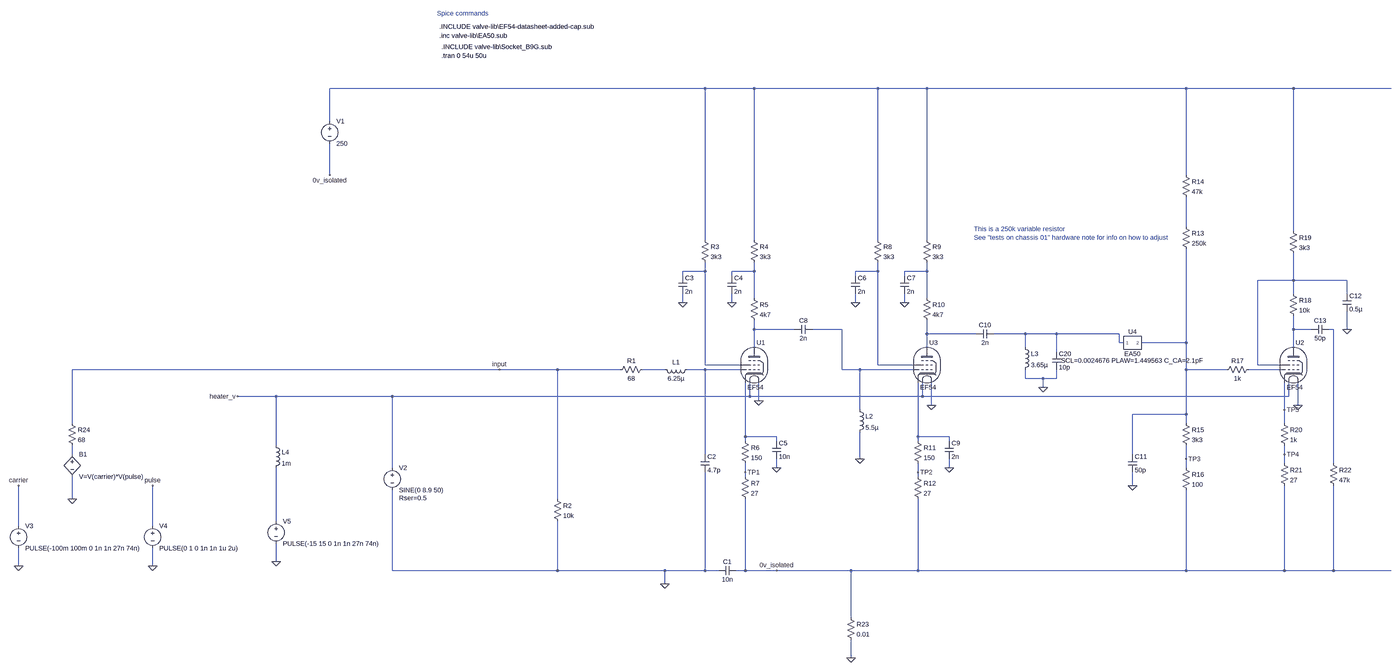
[diagram p0: schematic store_regen_input.asc, whole sheet]
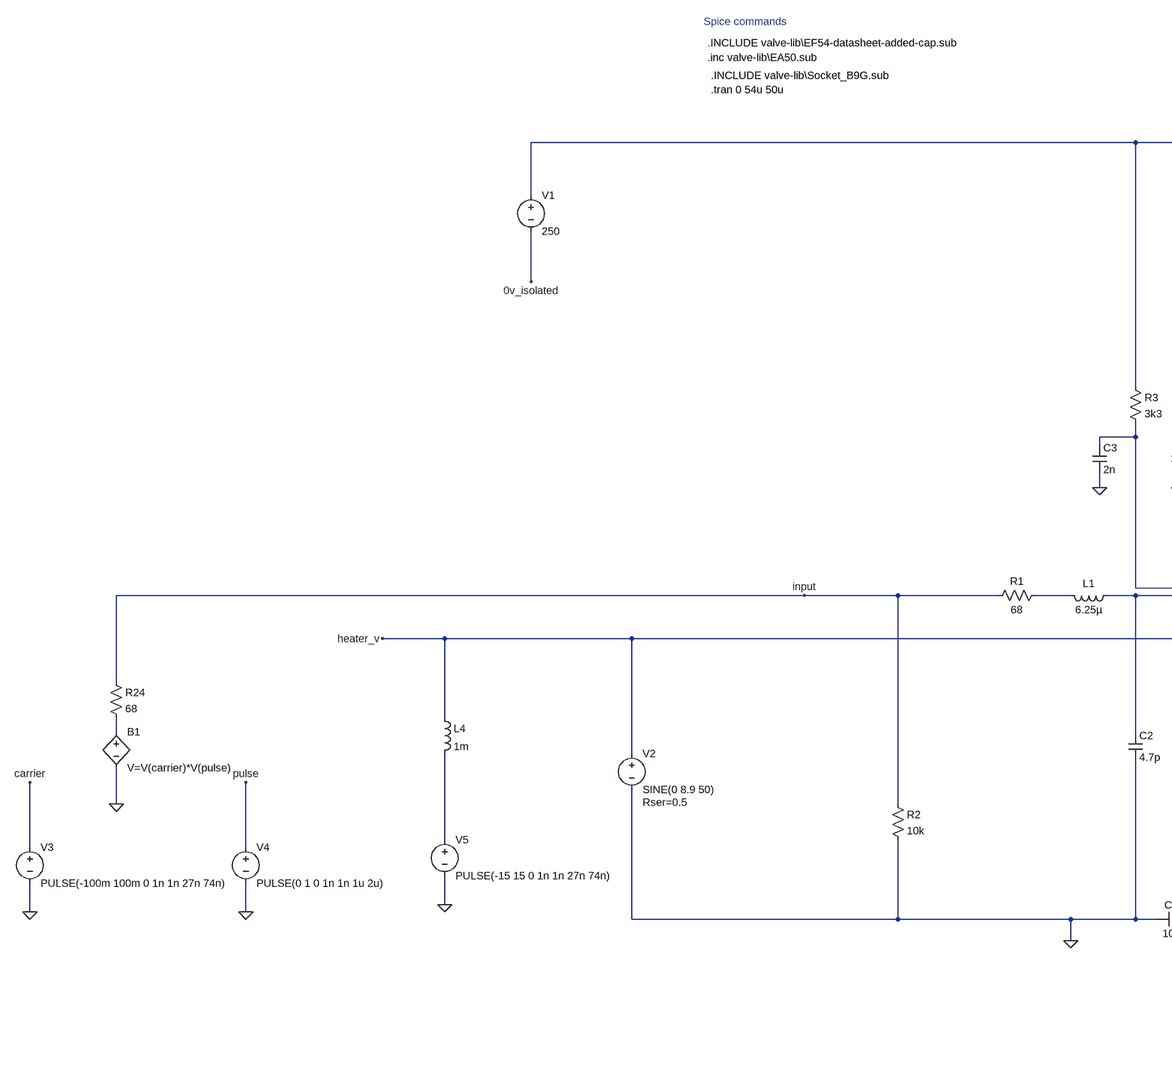
[diagram p1: schematic store_regen_input.asc, part, row 1 of 1, column 1 of 2]
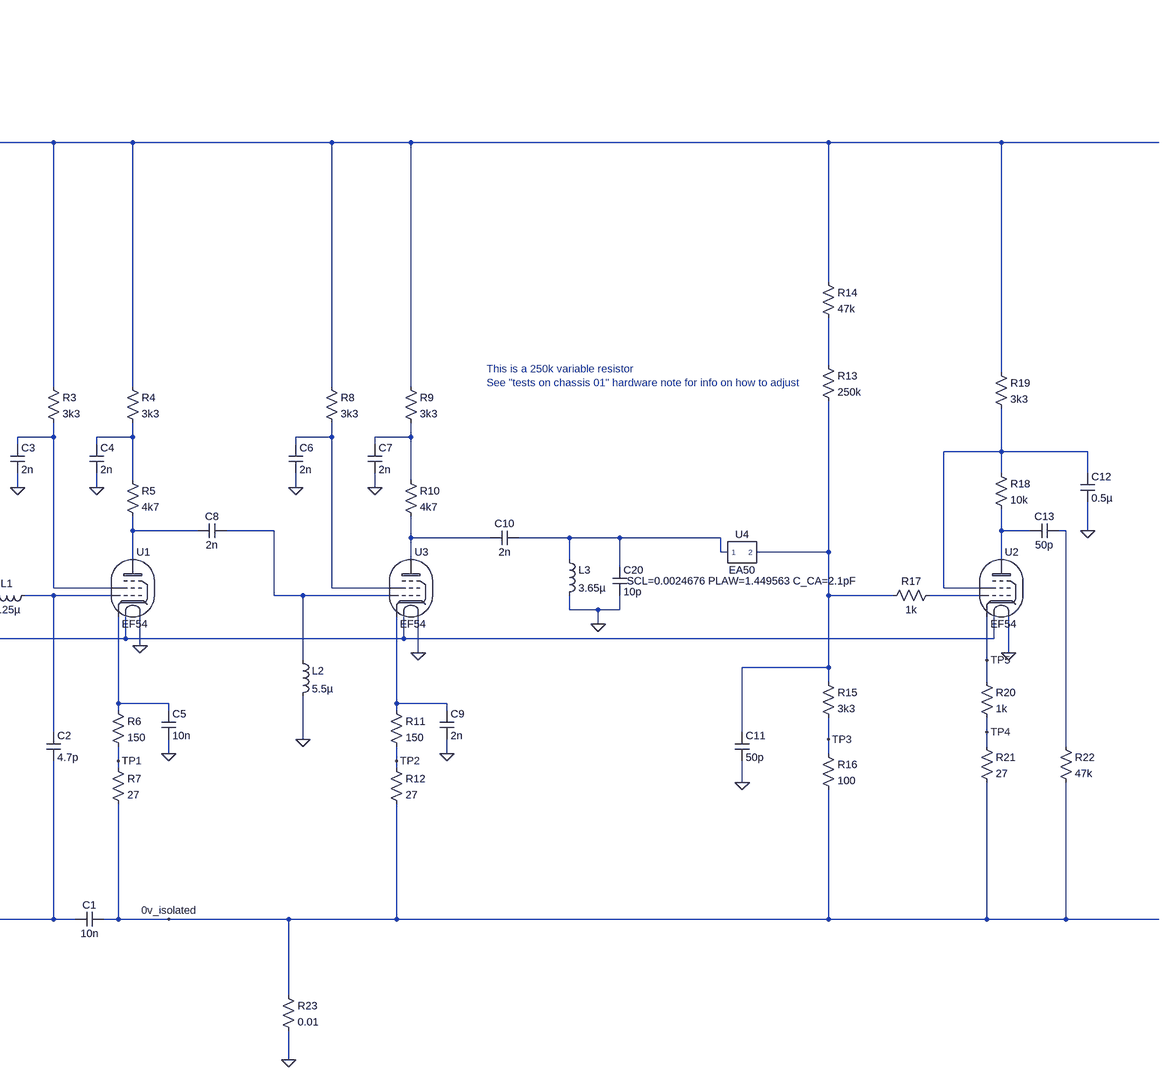
[diagram p2: schematic store_regen_input.asc, part, row 1 of 1, column 2 of 2]
store_regen_input.asc, the LTspice schematic file:
Version 4
SHEET 1 3124 1892
WIRE 240 -368 -1104 -368
WIRE 416 -368 240 -368
WIRE 880 -368 416 -368
WIRE 1056 -368 880 -368
WIRE 1984 -368 1056 -368
WIRE 2368 -368 1984 -368
WIRE 3120 -368 2368 -368
WIRE -1104 -80 -1104 -368
WIRE -1104 112 -1104 0
WIRE 1984 112 1984 -368
WIRE 1984 304 1984 192
WIRE 2368 320 2368 -368
WIRE 240 352 240 -368
WIRE 416 352 416 -368
WIRE 880 352 880 -368
WIRE 1056 352 1056 -368
WIRE 240 464 240 432
WIRE 240 464 160 464
WIRE 416 464 416 432
WIRE 416 464 336 464
WIRE 880 464 880 432
WIRE 880 464 800 464
WIRE 1056 464 1056 432
WIRE 1056 464 976 464
WIRE 160 480 160 464
WIRE 336 480 336 464
WIRE 800 480 800 464
WIRE 976 480 976 464
WIRE 2368 496 2368 400
WIRE 2368 496 2240 496
WIRE 2560 496 2368 496
WIRE 2368 544 2368 496
WIRE 2560 544 2560 496
WIRE 416 560 416 464
WIRE 1056 560 1056 464
WIRE 160 576 160 544
WIRE 336 576 336 544
WIRE 800 576 800 544
WIRE 976 576 976 544
WIRE 416 672 416 640
WIRE 560 672 416 672
WIRE 752 672 624 672
WIRE 2368 672 2368 624
WIRE 2432 672 2368 672
WIRE 2512 672 2496 672
WIRE 2560 672 2560 608
WIRE 1056 688 1056 640
WIRE 1232 688 1056 688
WIRE 1408 688 1296 688
WIRE 1520 688 1408 688
WIRE 1744 688 1520 688
WIRE 1744 720 1744 688
WIRE 1760 720 1744 720
WIRE 1984 720 1984 384
WIRE 1984 720 1824 720
WIRE 416 736 416 672
WIRE 1056 736 1056 688
WIRE 1408 736 1408 688
WIRE 2368 736 2368 672
WIRE 1520 752 1520 688
WIRE 240 800 240 464
WIRE 368 800 240 800
WIRE 880 800 880 464
WIRE 1008 800 880 800
WIRE 2240 800 2240 496
WIRE 2320 800 2240 800
WIRE -496 816 -2096 816
WIRE -288 816 -496 816
WIRE -64 816 -288 816
WIRE 96 816 16 816
WIRE 240 816 176 816
WIRE 368 816 240 816
WIRE 752 816 752 672
WIRE 816 816 752 816
WIRE 1008 816 816 816
WIRE 1984 816 1984 720
WIRE 2128 816 1984 816
WIRE 2320 816 2208 816
WIRE 1408 848 1408 816
WIRE 1472 848 1408 848
WIRE 1520 848 1520 816
WIRE 1520 848 1472 848
WIRE 1472 880 1472 848
WIRE -1296 912 -1504 912
WIRE -880 912 -1296 912
WIRE 400 912 400 864
WIRE 400 912 -880 912
WIRE 1040 912 1040 864
WIRE 1040 912 400 912
WIRE 2352 912 2352 864
WIRE 2352 912 1040 912
WIRE 432 928 432 864
WIRE 1072 944 1072 864
WIRE 2384 944 2384 864
WIRE 816 960 816 816
WIRE 2336 960 2336 864
WIRE 1984 976 1984 816
WIRE 1984 976 1792 976
WIRE -2096 1008 -2096 816
WIRE 1984 1008 1984 976
WIRE 2336 1008 2336 960
WIRE 384 1056 384 864
WIRE 496 1056 384 1056
WIRE 1024 1056 1024 864
WIRE 1136 1056 1024 1056
WIRE 384 1072 384 1056
WIRE 496 1072 496 1056
WIRE 1024 1072 1024 1056
WIRE 1136 1072 1136 1056
WIRE -1296 1088 -1296 912
WIRE -2096 1120 -2096 1088
WIRE 240 1120 240 816
WIRE 1792 1120 1792 976
WIRE 2336 1120 2336 1088
WIRE 816 1136 816 1040
WIRE 1984 1136 1984 1088
WIRE 2336 1152 2336 1120
WIRE 2512 1152 2512 672
WIRE -880 1168 -880 912
WIRE 496 1168 496 1136
WIRE 1136 1168 1136 1136
WIRE 1984 1168 1984 1136
WIRE 384 1184 384 1152
WIRE 1024 1184 1024 1152
WIRE 384 1200 384 1184
WIRE 1024 1200 1024 1184
WIRE 1792 1232 1792 1184
WIRE -2096 1280 -2096 1200
WIRE -288 1280 -288 816
WIRE -1296 1360 -1296 1168
WIRE -2288 1376 -2288 1232
WIRE -1808 1376 -1808 1232
WIRE -1296 1504 -1296 1440
WIRE -2288 1520 -2288 1456
WIRE -1808 1520 -1808 1456
WIRE -880 1536 -880 1248
WIRE -288 1536 -288 1360
WIRE -288 1536 -880 1536
WIRE 96 1536 -288 1536
WIRE 240 1536 240 1184
WIRE 240 1536 96 1536
WIRE 288 1536 240 1536
WIRE 384 1536 384 1280
WIRE 384 1536 352 1536
WIRE 496 1536 384 1536
WIRE 784 1536 496 1536
WIRE 1024 1536 1024 1280
WIRE 1024 1536 784 1536
WIRE 1984 1536 1984 1248
WIRE 1984 1536 1024 1536
WIRE 2336 1536 2336 1232
WIRE 2336 1536 1984 1536
WIRE 2512 1536 2512 1232
WIRE 2512 1536 2336 1536
WIRE 3120 1536 2512 1536
WIRE 96 1584 96 1536
WIRE 784 1728 784 1536
WIRE 784 1872 784 1808
FLAG -496 816 input
FLAG 96 1584 0
FLAG 496 1536 0v_isolated
FLAG -1104 112 0v_isolated
FLAG 160 576 0
FLAG 336 576 0
FLAG 496 1168 0
FLAG 800 576 0
FLAG 976 576 0
FLAG 432 928 0
FLAG 1072 944 0
FLAG -1504 912 heater_v
FLAG 816 1136 0
FLAG 1136 1168 0
FLAG 1472 880 0
FLAG 1792 1232 0
FLAG 2560 672 0
FLAG 2384 944 0
FLAG 2336 960 TP5
FLAG 2336 1120 TP4
FLAG 1984 1136 TP3
FLAG 1024 1184 TP2
FLAG 384 1184 TP1
FLAG 784 1872 0
FLAG -2288 1520 0
FLAG -1808 1520 0
FLAG -2288 1232 carrier
FLAG -1808 1232 pulse
FLAG -2096 1280 0
FLAG -1296 1504 0
SYMBOL EF54 416 800 R0
SYMATTR InstName U1
SYMBOL res 32 800 R90
WINDOW 0 0 56 VBottom 2
WINDOW 3 32 56 VTop 2
SYMATTR InstName R1
SYMATTR Value 68
SYMBOL ind 192 800 R90
WINDOW 0 5 56 VBottom 2
WINDOW 3 32 56 VTop 2
SYMATTR InstName L1
SYMATTR Value 6.25µ
SYMBOL res -304 1264 R0
SYMATTR InstName R2
SYMATTR Value 10k
SYMBOL cap 352 1520 R90
WINDOW 0 0 32 VBottom 2
WINDOW 3 32 32 VTop 2
SYMATTR InstName C1
SYMATTR Value 10n
SYMBOL cap 224 1120 R0
SYMATTR InstName C2
SYMATTR Value 4.7p
SYMBOL voltage -1104 -96 R0
WINDOW 123 0 0 Left 2
WINDOW 39 0 0 Left 2
SYMATTR InstName V1
SYMATTR Value 250
SYMBOL res 224 336 R0
SYMATTR InstName R3
SYMATTR Value 3k3
SYMBOL cap 144 480 R0
SYMATTR InstName C3
SYMATTR Value 2n
SYMBOL res 400 336 R0
SYMATTR InstName R4
SYMATTR Value 3k3
SYMBOL cap 320 480 R0
SYMATTR InstName C4
SYMATTR Value 2n
SYMBOL res 400 544 R0
SYMATTR InstName R5
SYMATTR Value 4k7
SYMBOL res 368 1056 R0
SYMATTR InstName R6
SYMATTR Value 150
SYMBOL res 368 1184 R0
SYMATTR InstName R7
SYMATTR Value 27
SYMBOL cap 480 1072 R0
SYMATTR InstName C5
SYMATTR Value 10n
SYMBOL EF54 1056 800 R0
SYMATTR InstName U3
SYMBOL res 864 336 R0
SYMATTR InstName R8
SYMATTR Value 3k3
SYMBOL cap 784 480 R0
SYMATTR InstName C6
SYMATTR Value 2n
SYMBOL res 1040 336 R0
SYMATTR InstName R9
SYMATTR Value 3k3
SYMBOL cap 960 480 R0
SYMATTR InstName C7
SYMATTR Value 2n
SYMBOL res 1040 544 R0
SYMATTR InstName R10
SYMATTR Value 4k7
SYMBOL cap 624 656 R90
WINDOW 0 0 32 VBottom 2
WINDOW 3 32 32 VTop 2
SYMATTR InstName C8
SYMATTR Value 2n
SYMBOL ind 800 944 R0
SYMATTR InstName L2
SYMATTR Value 5.5µ
SYMBOL res 1008 1056 R0
SYMATTR InstName R11
SYMATTR Value 150
SYMBOL res 1008 1184 R0
SYMATTR InstName R12
SYMATTR Value 27
SYMBOL cap 1120 1072 R0
SYMATTR InstName C9
SYMATTR Value 2n
SYMBOL cap 1296 672 R90
WINDOW 0 0 32 VBottom 2
WINDOW 3 32 32 VTop 2
SYMATTR InstName C10
SYMATTR Value 2n
SYMBOL ind 1392 720 R0
SYMATTR InstName L3
SYMATTR Value 3.65µ
SYMBOL cap 1504 752 R0
SYMATTR InstName C20
SYMATTR Value 10p
SYMBOL res 1968 288 R0
SYMATTR InstName R13
SYMATTR Value 250k
SYMBOL res 1968 96 R0
SYMATTR InstName R14
SYMATTR Value 47k
SYMBOL res 1968 992 R0
SYMATTR InstName R15
SYMATTR Value 3k3
SYMBOL res 1968 1152 R0
SYMATTR InstName R16
SYMATTR Value 100
SYMBOL cap 1776 1120 R0
SYMATTR InstName C11
SYMATTR Value 50p
SYMBOL EF54 2368 800 R0
SYMATTR InstName U2
SYMBOL res 2224 800 R90
WINDOW 0 0 56 VBottom 2
WINDOW 3 32 56 VTop 2
SYMATTR InstName R17
SYMATTR Value 1k
SYMBOL res 2352 528 R0
SYMATTR InstName R18
SYMATTR Value 10k
SYMBOL res 2352 304 R0
SYMATTR InstName R19
SYMATTR Value 3k3
SYMBOL cap 2544 544 R0
SYMATTR InstName C12
SYMATTR Value 0.5µ
SYMBOL res 2320 992 R0
SYMATTR InstName R20
SYMATTR Value 1k
SYMBOL res 2320 1136 R0
SYMATTR InstName R21
SYMATTR Value 27
SYMBOL res 2496 1136 R0
SYMATTR InstName R22
SYMATTR Value 47k
SYMBOL cap 2496 656 R90
WINDOW 0 0 32 VBottom 2
WINDOW 3 32 32 VTop 2
SYMATTR InstName C13
SYMATTR Value 50p
SYMBOL voltage -880 1152 R0
WINDOW 123 0 0 Left 2
WINDOW 39 24 124 Left 2
SYMATTR SpiceLine Rser=0.5
SYMATTR InstName V2
SYMATTR Value SINE(0 8.9 50)
SYMBOL res 768 1712 R0
SYMATTR InstName R23
SYMATTR Value 0.01
SYMBOL EA50_box 1792 720 R0
SYMATTR InstName U4
SYMBOL voltage -2288 1360 R0
WINDOW 123 0 0 Left 2
WINDOW 39 0 0 Left 2
SYMATTR InstName V3
SYMATTR Value PULSE(-100m 100m 0 1n 1n 27n 74n)
SYMBOL voltage -1808 1360 R0
WINDOW 123 0 0 Left 2
WINDOW 39 0 0 Left 2
SYMATTR InstName V4
SYMATTR Value PULSE(0 1 0 1n 1n 1u 2u)
SYMBOL bv -2096 1104 R0
SYMATTR InstName B1
SYMATTR Value V=V(carrier)*V(pulse)
SYMBOL res -2112 992 R0
SYMATTR InstName R24
SYMATTR Value 68
SYMBOL voltage -1296 1344 R0
WINDOW 123 0 0 Left 2
WINDOW 39 0 0 Left 2
SYMATTR InstName V5
SYMATTR Value PULSE(-15 15 0 1n 1n 27n 74n)
SYMBOL ind -1312 1072 R0
SYMATTR InstName L4
SYMATTR Value 1m
TEXT -712 -736 Left 2 !.INCLUDE valve-lib\\EF54-datasheet-added-cap.sub
TEXT -704 -632 Left 2 !.tran 0 54u 50u
TEXT -720 -784 Left 2 ;Spice commands
TEXT -712 -704 Left 2 !.inc valve-lib\\EA50.sub
TEXT -704 -664 Left 2 !.INCLUDE valve-lib\\Socket_B9G.sub
TEXT 1224 312 Left 2 ;This is a 250k variable resistor\nSee "tests on chassis 01" hardware note for info on how to adjust

The netlist it stands for:
* store_regen_input.asc
XU1 N016 N003 N008 N018 0 heater_v EF54  ; pins G1 G2 Anode Cathode Heater_R Heater_L
R1 N015 input 68
L1 N016 N015 6.25µ
R2 input 0 10k
C1 0v_isolated 0 10n
C2 N016 0 4.7p
V1 N001 0v_isolated 250
R3 N001 N003 3k3
C3 N003 0 2n
R4 N001 N004 3k3
C4 N004 0 2n
R5 N004 N008 4k7
R6 N018 TP1 150
R7 TP1 0v_isolated 27
C5 N018 0 10n
XU3 N009 N005 N012 N019 0 heater_v EF54  ; pins G1 G2 Anode Cathode Heater_R Heater_L
R8 N001 N005 3k3
C6 N005 0 2n
R9 N001 N006 3k3
C7 N006 0 2n
R10 N006 N012 4k7
C8 N009 N008 2n
L2 N009 0 5.5µ
R11 N019 TP2 150
R12 TP2 0v_isolated 27
C9 N019 0 2n
C10 N013 N012 2n
L3 N013 0 3.65µ
C20 N013 0 10p
R13 N002 N014 250k
R14 N001 N002 47k
R15 N014 TP3 3k3
R16 TP3 0v_isolated 100
C11 N014 0 50p
XU2 N017 N007 N010 TP5 0 heater_v EF54  ; pins G1 G2 Anode Cathode Heater_R Heater_L
R17 N017 N014 1k
R18 N007 N010 10k
R19 N001 N007 3k3
C12 N007 0 0.5µ
R20 TP5 TP4 1k
R21 TP4 0v_isolated 27
R22 N011 0v_isolated 47k
C13 N011 N010 50p
V2 heater_v 0 SINE(0 8.9 50) Rser=0.5
R23 0v_isolated 0 0.01
XU4 N013 N014 EA50 SCL=0.0024676 PLAW=1.449563 C_CA=2.1pF  ; pins 1 2
V3 carrier 0 PULSE(-100m 100m 0 1n 1n 27n 74n)
V4 pulse 0 PULSE(0 1 0 1n 1n 1u 2u)
B1 N020 0 V=V(carrier)*V(pulse)
R24 input N020 68
V5 N021 0 PULSE(-15 15 0 1n 1n 27n 74n)
L4 heater_v N021 1m
.INCLUDE valve-lib\EF54-datasheet-added-cap.sub
.tran 0 54u 50u
* Spice commands
.inc valve-lib\EA50.sub
.INCLUDE valve-lib\Socket_B9G.sub
* This is a 250k variable resistor
* See "tests on chassis 01" hardware note for info on how to adjust
.lib Z:\home\josh\Dropbox\My Documents\Uni work\MSc\Embedded Systems\Project\repository\spice\valve-lib\EA50.sub
.backanno
.end